# Altium project MSXIV_SteeringWheelInterfaceBoard.PrjPcb
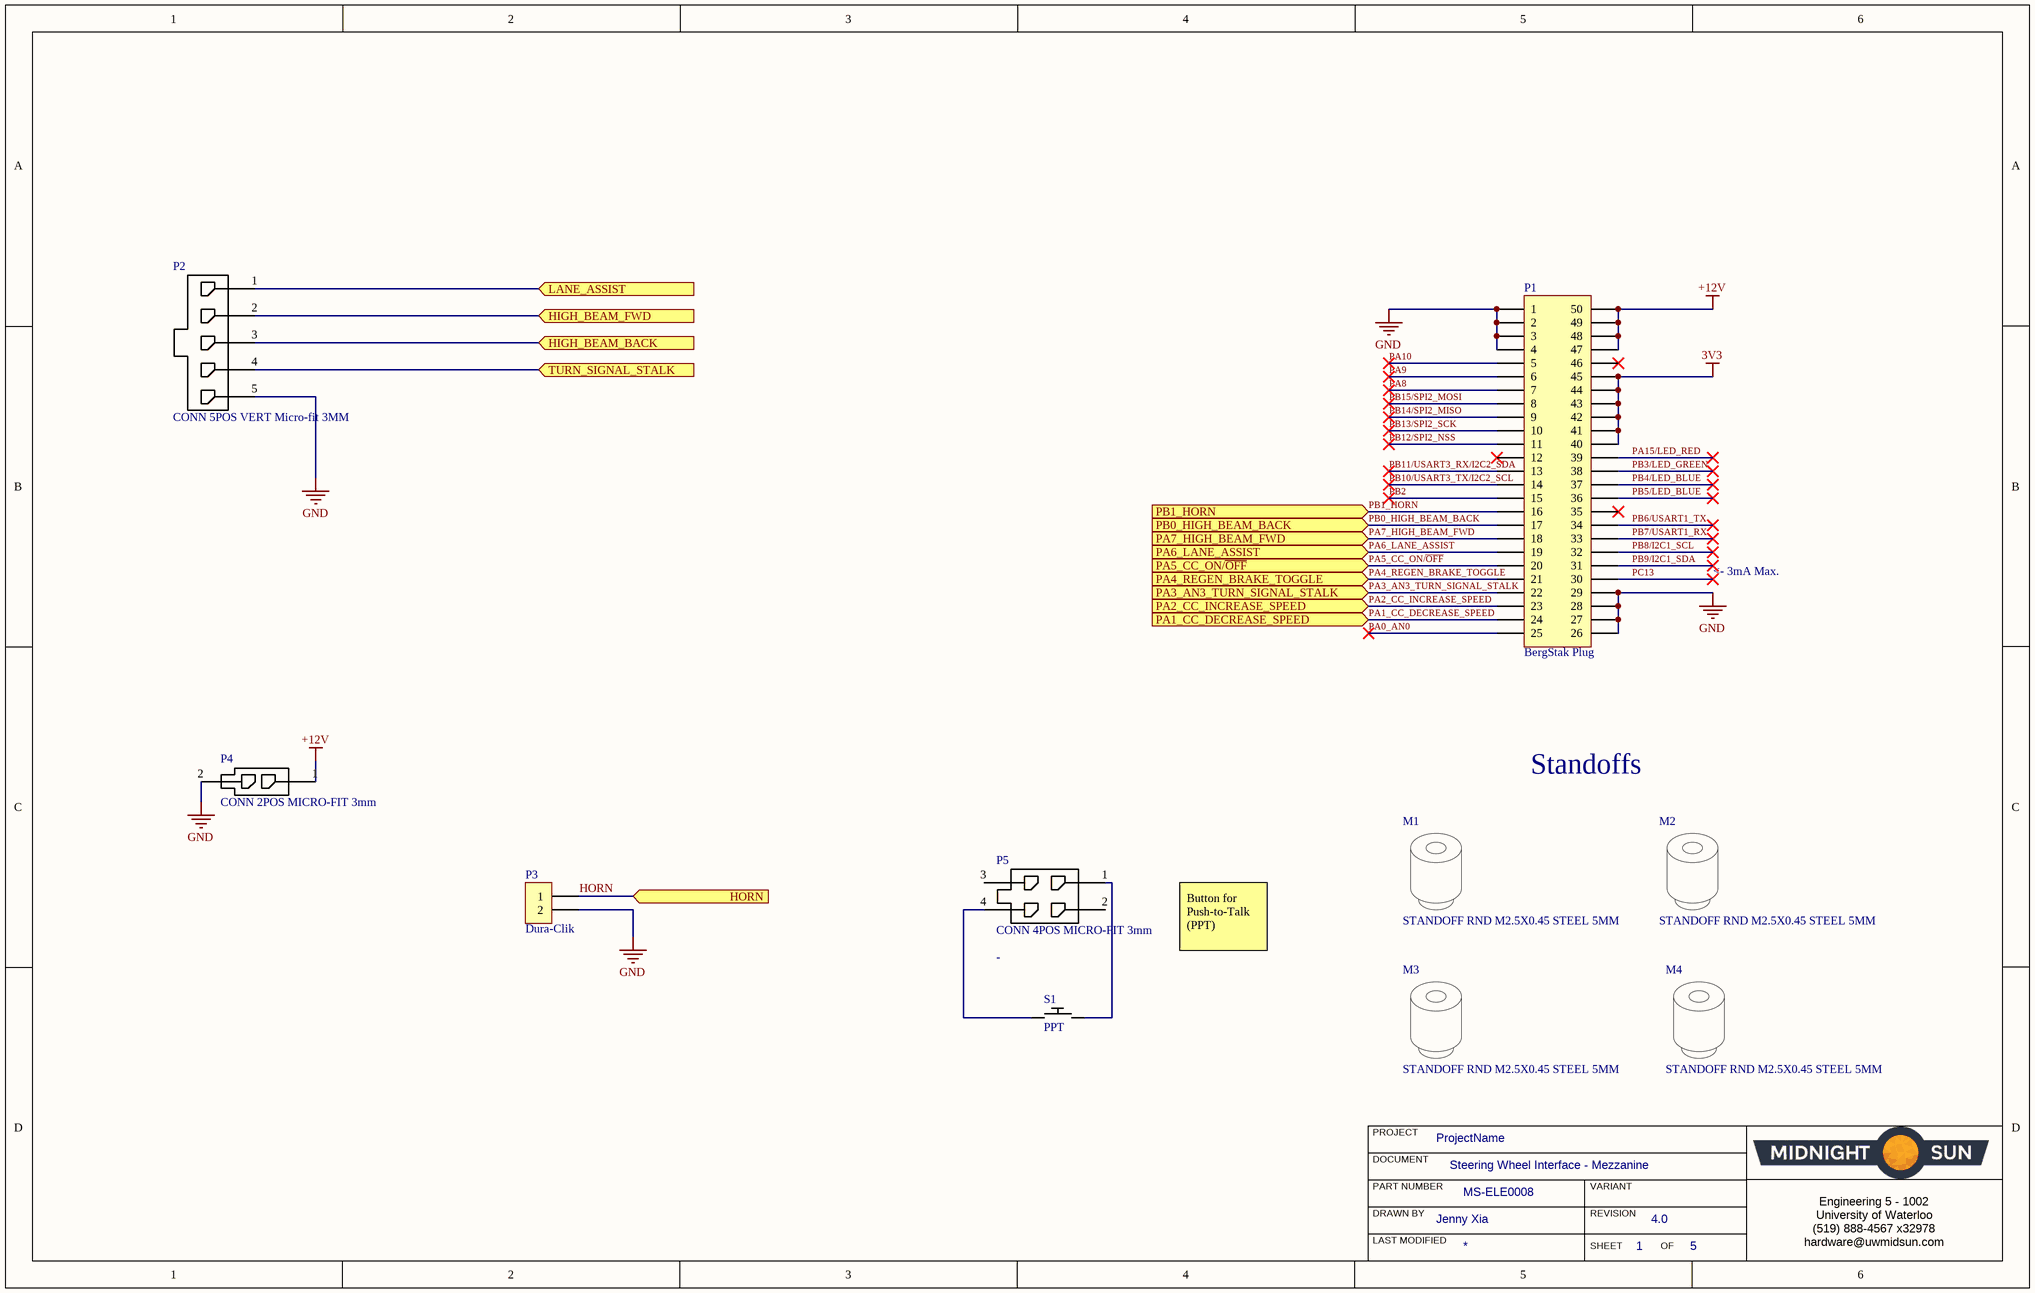
[diagram p0: Steering Wheel Carrier Board Mezzanine.SchDoc]
MSPartNumber: MS-ELE0008; ProjectAuthor: Jenny Xia; ProjectRevision: 4.0
5 sheets, 64 parts. Net scope: flat (ports and power ports of the same name join across sheets).
Board files: SteeringWheelConnectorBoard.PcbDoc, SteeringWheelBoard.PcbDoc
Sheets:
  Steering Wheel Carrier Board Mezzanine.SchDoc
  Steering Wheel Steering Stalk Connector.SchDoc
  Steering Wheel Interface Analog Inputs.SchDoc
  Steering Wheel Interface Digital Inputs.SchDoc
  Steering Wheel Interface Schmitt Inverters.SchDoc

## Sheet Steering Wheel Carrier Board Mezzanine.SchDoc: Steering Wheel Interface - Mezzanine
size B; Organization: Midnight Sun Solar Rayce Car Team; Address1: University of Waterloo; Address2: 200 University Ave W; Address3: Waterloo, ON, Canada; Address4: N2L 3E9; DocumentNumber: 1; SheetNumber: 1; SheetTotal: 5; Website: www.uwmidsun.com; ProjectName: ProjectName

### Parts
M1  STANDOFF RND M2.5X0.45 STEEL 5MM  [M2.5 Standoff]
M2  STANDOFF RND M2.5X0.45 STEEL 5MM  [M2.5 Standoff]
M3  STANDOFF RND M2.5X0.45 STEEL 5MM  [M2.5 Standoff]
M4  STANDOFF RND M2.5X0.45 STEEL 5MM  [M2.5 Standoff]
P1  Series: BergStak Plug  [CONN, Bergstak 50 Pos Plug]  (hidden comment: CONN 50POS Bergstak Plug 0.02")
P2  CONN 5POS VERT Micro-fit 3MM  [CONN, 5POS MICRO-FIT 3mm]
P3  Dura-Clik  [CONN, 2POS Dura-Click Vertical]
P4  CONN 2POS MICRO-FIT 3mm  [CONN, 2POS MICRO-FIT]
P5  CONN 4POS MICRO-FIT 3mm  [CONN 4POS MICROFIT (2x2)]
S1  PPT  [SW SPST-NO ESE-20C321]

### Ports
HIGH_BEAM_BACK (in), HIGH_BEAM_FWD (in), HORN (in), LANE_ASSIST (in), PA1_CC_DECREASE_SPEED (in), PA2_CC_INCREASE_SPEED (in), PA3_AN3_TURN_SIGNAL_STALK (in), PA4_REGEN_BRAKE_TOGGLE (in), PA5_CC_ON/~{OFF} (in), PA6_LANE_ASSIST (in), PA7_HIGH_BEAM_FWD (in), PB0_HIGH_BEAM_BACK (in), PB1_HORN (in), TURN_SIGNAL_STALK (in)

### Nets
3V3: P1.40 P1.41 P1.42 P1.43 P1.44 P1.45
+12V: P1.47 P1.48 P1.49 P1.50 P4.1
GND: P1.1 P1.2 P1.3 P1.4 P1.26 P1.27 P1.28 P1.29 P2.5 P3.2 P4.2
HIGH_BEAM_BACK: P2.3 ; port HIGH_BEAM_BACK
HIGH_BEAM_FWD: P2.2 ; port HIGH_BEAM_FWD
HORN: P3.1 ; port HORN
LANE_ASSIST: P2.1 ; port LANE_ASSIST
PA0_AN0: P1.25
PA1_CC_DECREASE_SPEED: P1.24 ; port PA1_CC_DECREASE_SPEED
PA2_CC_INCREASE_SPEED: P1.23 ; port PA2_CC_INCREASE_SPEED
PA3_AN3_TURN_SIGNAL_STALK: P1.22 ; port PA3_AN3_TURN_SIGNAL_STALK
PA4_REGEN_BRAKE_TOGGLE: P1.21 ; port PA4_REGEN_BRAKE_TOGGLE
PA5_CC_ON/~{OFF}: P1.20 ; port PA5_CC_ON/~{OFF}
PA6_LANE_ASSIST: P1.19 ; port PA6_LANE_ASSIST
PA7_HIGH_BEAM_FWD: P1.18 ; port PA7_HIGH_BEAM_FWD
PA8: P1.7
PA9: P1.6
PA10: P1.5
PA15/LED_RED: P1.39
PB0_HIGH_BEAM_BACK: P1.17 ; port PB0_HIGH_BEAM_BACK
PB1_HORN: P1.16 ; port PB1_HORN
PB2: P1.15
PB3/LED_GREEN: P1.38
PB4/LED_BLUE: P1.37
PB5/LED_BLUE: P1.36
PB6/USART1_TX: P1.34
PB7/USART1_RX: P1.33
PB8/I2C1_SCL: P1.32
PB9/I2C1_SDA: P1.31
PB10/USART3_TX/I2C2_SCL: P1.14
PB11/USART3_RX/I2C2_SDA: P1.13
PB12/SPI2_NSS: P1.11
PB13/SPI2_SCK: P1.10
PB14/SPI2_MISO: P1.9
PB15/SPI2_MOSI: P1.8
PC13: P1.30
TURN_SIGNAL_STALK: P2.4 ; port TURN_SIGNAL_STALK
NetP5_1: P5.1 S1.2
NetP5_4: P5.4 S1.1

Not connected (* = marked no-connect by the designer): P1 12* 35* 46*; P5 2 3

### Notes on the sheet
- <- 3mA Max.
- (near M2) Standoffs
- Button for Push-to-Talk (PPT)
- PROJECT
- DOCUMENT
- DRAWN BY
- LAST MODIFIED
- PART NUMBER
- REVISION
- SHEET
- VARIANT
- OF
- Engineering 5 - 1002
  University of Waterloo
  (519) 888-4567 x32978
  hardware@uwmidsun.com

### Library data of the parts
M1-M4 = CMP-003-0255-1: Manufacturer: Wurth Electronics; Manufacturer Part Number: 9774050151R; Plating: Tin; Outside Diameter: 0.201inch; Threaded/Unthreaded: Threaded; Pricing 1: 1 = 1.09000, 10 = 1.03000, 50 = 0.91800, 100 = 0.84000 (USD); Material: Steel; Stock 1: 24846; Design Item ID: STANDOFF RND M2.5X0.45 STEEL 5MM; REACH SVHC: Unknown; Source: Schematic Diagrams.SchLib; RoHS: Yes; Length: 0.252inch
P1 = CONN 50POS Bergstak Plug 0.02": 50 Position Connector Plug, Outer Shroud Contacts Surface Mount Gold; Manufacturer 1: Amphenol FCI; Manufacturer Part Number 1: 10132797-055100LF; Number of Positions: 50; Mated Stacking Heights: 5mm; Pitch: 0.020" (0.50mm); Supplier 1: Digi-Key; Supplier Part Number 1: 609-5226-1-ND; Packaging: Cut Tape (CT); Part Status: Active; Connector Type: Plug, Outer Shroud Contacts; Number of Rows: 2; Mounting Type: Surface Mount; Contact Finish: Gold; Contact Finish Thickness: 1µin (0.025µm); Height Above Board: 0.169" (4.30mm); ComponentLink1URL: http://portal.fciconnect.com/Comergent//fci/drawing/10132797.pdf; ComponentLink1Description: http://portal.fciconnect.com/Comergent//fci/drawing/10132797.pdf
P2 = CMP-022-0000-1: Conn Power HDR 5 POS 3mm Solder ST Thru-Hole 5 Terminal 1 Port Micro-Fit 3.0™ Tray; Manufacturer Part Number: 0436500516; Manufacturer: Molex; Max Voltage Rating (AC): 250V; Connector Type: Male Pin; Number of Contacts: 5; Number of Ports: 1; Min Operating Temperature: -40°C; Source: SchlibSolarSense.SchLib; Design Item ID: CONN 5POS VERT Micro-fit 3MM; Number of Terminals: 5; Stock 1: 1615; Orientation: Straight; Contact Plating: Gold; Contact Material: Brass; Number of Rows: 1; Fastening Type: Ramp; Max Operating Temperature: 105°C; Termination: Solder; Mount: Through Hole; ComponentLink1URL: https://datasheet.ciiva.com/6813/436500516-sd-6813986.pdf?src-supplier=Digi-Key; Color: Black; Length: 18.65mm; ComponentLink1Description: https://datasheet.ciiva.com/6813/436500516-sd-6813986.pdf?src-supplier=Digi-Key; Number of Positions: 5; ComponentLink2URL: https://datasheet.ciiva.com/3943/304280436500516-pcb-headers-3943315.pdf?src-supplier=Arrow; Packaging: Tray; Pitch: 3mm; Housing Material: Polymer; RoHS: Yes; ComponentLink2Description: https://datasheet.ciiva.com/3943/304280436500516-pcb-headers-3943315.pdf?src-supplier=Arrow; Pricing 1: 1=1.52000, 10=1.38200, 100=1.18480, 500=0.98736, 1000=0.84630, 5000=0.75039, 10000=0.73346 (USD); Depth: 5.57mm
P3 = CONN 2POS DURA-CLIK 0.079" VERT: 2 Positions Header, Shrouded Connector 0.079" (2.00mm) Surface Mount, Vertical Tin; Manufacturer: Molex, LLC; Manufacturer Part Number: 5600200220; Style: Board to Cable/Wire; Shrouding: Shrouded - 4 Wall; Number of Positions: 2; Number of Positions Loaded: All; Mated Stacking Heights: 9.3mm; Supplier 1: Digi-Key; RoHS: RoHS Compliant; Category: Connectors, Interconnects; Stock 1: 11912; Pricing 1: 1=1.16, 10=1.012, 25=0.952, 50=0.9122, 100=0.8727, 250=0.79336 (CAD); Packaging: Cut Tape (CT); Part Status: Active; Connector Type: Header; Contact Type: Male Pin; Pitch - Mating: 0.079" (2.00mm); Number of Rows: 1; Row Spacing - Mating: -; Mounting Type: Surface Mount; Termination: Solder; Fastening Type: Latch Lock; Contact Length - Mating: -; Contact Length - Post: -; Overall Contact Length: -; Insulation Height: 0.315" (8.00mm); Contact Shape: Square; Contact Finish - Mating: Tin; Contact Finish Thickness - Mating: -; Contact Finish - Post: Tin; Contact Material: Copper Alloy; Insulation Material: Polyamide (PA), Nylon; Features: Solder Retention; Operating Temperature: -; Ingress Protection: -; Material Flammability Rating: -; Insulation Color: Natural; Current Rating: -; Voltage Rating: -; Contact Finish Thickness - Post: -; Applications: Automotive, Industrial; ComponentLink1URL: http://www.molex.com/pdm_docs/sd/5600200220_sd.pdf; ComponentLink1Description: http://www.molex.com/pdm_docs/sd/5600200220_sd.pdf; Supplier Part Number 1: WM10862CT-ND
P4 = CMP-007-0003-1: Connector Header Through Hole 2 position; Manufacturer: Molex; Manufacturer Part Number: 43045-0227; Number of Ports: 1; Number of Contacts: 2; Glow Wire Compliant: Compliant; Voltage Rating: 600V; Current Rating: 5A; Max Voltage Rating (DC): 250.25kV; Gender: Male; Contact Resistance: 10mR; ComponentLink3URL: http://uk.rs-online.com/webdocs/13c3/0900766b813c3a46.pdf; Contact Material: Brass; Halogen Free: Low Halogen; ComponentLink2URL: http://www.mouser.com/ds/2/276/0430450227_PCB_HEADERS-142611.pdf; Length: 7.15mm; Source: Schematic Diagrams.SchLib; Min Operating Temperature: -40°C; Contact Plating: Tin; Number of Terminals: 2; Number of Rows: 2; Radiation Hardening: No; ComponentLink4URL: http://www.molex.com/webdocs/datasheets/pdf/en-us/0430450227_PCB_HEADERS.pdf; Packaging: Tray; Depth: 8.77mm; Pitch: 3mm; Stock 1: 3657; Mount: Through Hole; Max Operating Temperature: 105°C; ComponentLink1Description: http://www.onlinecomponents.com/productFiles/mf-MOL/307170430450227_pcb_headers.pdf; Orientation: Vertical; Row Spacing: 3mm; Case/Package: 3168; Pricing 1: 1=0.84, 10=0.74, 25=0.6968, 50=0.6676, 100=0.6387, 250=0.5806, 500=0.52254, 1000=0.46448, 2500=0.42094 (USD); ComponentLink2Description: http://www.mouser.com/ds/2/276/0430450227_PCB_HEADERS-142611.pdf; ComponentLink3Description: http://uk.rs-online.com/webdocs/13c3/0900766b813c3a46.pdf; ComponentLink1URL: http://www.onlinecomponents.com/productFiles/mf-MOL/307170430450227_pcb_headers.pdf; Number of Positions: 2; Design Item ID: CONN 2POS MICRO-FIT 3mm; Housing Colour: Black; Termination: Solder; Number of Circuits: 2; ComponentLink4Description: http://www.molex.com/webdocs/datasheets/pdf/en-us/0430450227_PCB_HEADERS.pdf; Housing Material: Thermoplastic
P5 = CMP-003-0192-1: Micro-Fit 3.0 Vertical Header, 3.00mm Pitch, Dual Row, 4 Circuits, with PCB Polarizing Peg, Tin, Glow-Wire Capable, Black; Manufacturer: Molex, LLC; Manufacturer Part Number: 430450427; Contact Resistance: 10mR; Pitch - Mating: 0.118" (3.00mm); Number of Contacts: 4; Number of Ports: 1; Number of Positions: 6; Row Spacing: 0.118inch; Style: Board to Cable/Wire; Shrouding: Shrouded - 4 Wall; Material Flammability Rating: UL94 V-0; Contact Length - Post: 0.125" (3.18mm); Number of Positions Loaded: All; Contact Finish Thickness - Post: -; RoHS: RoHS Compliant; Ingress Protection: -; Number of Rows: 2; Operating Temperature: -; Contact Material: Brass; Contact Finish - Mating: Tin; Mounting Type: Through Hole; Current Rating: -; Overall Contact Length: -; Insulation Material: Liquid Crystal Polymer (LCP), Glass Filled; Design Item ID: CONN 4POS MICRO-FIT 3mm; Voltage Rating: -; Depth: 8.77mm; Part Status: Active; ComponentLink1Description: http://www.molex.com/webdocs/datasheets/pdf/en-us/0430450427_PCB_HEADERS.pdf; Pitch: 3mm; Packaging: Tray; Mated Stacking Heights: -; Contact Length - Mating: -; Features: Board Guide; Row Spacing - Mating: 0.118" (3.00mm); Fastening Type: Locking Ramp; Orientation: Straight; Length: 10.15mm; Housing Material: Polymer; Mount: Through Hole; Insulation Height: 0.390" (9.91mm); Termination: Solder; Connector Type: Header; Package Quantity: 2232; Housing Color: Black; Contact Plating: Tin; ComponentLink1URL: http://www.molex.com/webdocs/datasheets/pdf/en-us/0430450427_PCB_HEADERS.pdf; Number of Terminals: 4; Insulation Color: Black; Source: Schematic Diagrams.SchLib; Contact Finish Thickness - Mating: 60.0µin (1.52µm); Contact Finish - Post: Tin; Min Operating Temperature: -40°C; Contact Type: Male Pin; Max Operating Temperature: 105°C; Contact Shape: Square; Color: Black; Applications: General Purpose, Medical, Military, Telecommunications
S1 = SW PUSH SPST-NO 0.1A 14V: Pushbutton Switch SPST-NO Standard Through Hole; Manufacturer: Panasonic; Manufacturer Part Number: ESE20C321; Switch Function: Off-Mom; Actuator Type: Square, Button; Operating Force: 4N; Voltage Rating (DC): 14V; Throw Configuration: SPST; Current Rating: 100mA; Supplier 1: Digi-Key; Supplier Part Number 1: P11161S-ND; RoHS: Yes; Stock 1: 1919; Pricing 1: 1 = 1.17000, 10 = 1.09200, 25 = 1.04040, 50 = 0.98820, 100 = 0.96220, 250 = 0.93620, 500 = 0.88418, 1000 = 0.83216, 5000 = 0.70214 (USD); Packaging: Bulk; ComponentLink1URL: https://www.digikey.ca/product-detail/en/panasonic-electronic-components/ESE-20C321/P11161S-ND/354749; ComponentLink1Description: Digikey; Mount: Through Hole; Min Operating Temperature: -30°C; Max Operating Temperature: 80°C; Max Voltage Rating (DC): 14V; Package Quantity: 1200; Contact Current Rating: 100mA; Termination: PC Pin; Orientation: Straight; Radiation Hardening: No; REACH SVHC: No SVHC; Lead Free: Lead Free; ComponentLink2URL: https://datasheet.ciiva.com/46399/1790644-46399477.pdf?src-supplier=Element14; ComponentLink2Description: https://datasheet.ciiva.com/46399/1790644-46399477.pdf?src-supplier=Element14; ComponentLink3URL: https://datasheet.ciiva.com/16437/atu0000ce7-16437878.pdf?src-supplier=Future+Electronics; ComponentLink3Description: https://datasheet.ciiva.com/16437/atu0000ce7-16437878.pdf?src-supplier=Future+Electronics; ComponentLink4URL: https://datasheet.ciiva.com/8663/atu0000ce7-8663607.pdf?src-supplier=Avnet; ComponentLink4Description: https://datasheet.ciiva.com/8663/atu0000ce7-8663607.pdf?src-supplier=Avnet; ComponentLink5URL: https://datasheet.ciiva.com/2869/atu0000ce7-2869467.pdf?src-supplier=Digi-Key; ComponentLink5Description: https://datasheet.ciiva.com/2869/atu0000ce7-2869467.pdf?src-supplier=Digi-Key

## Sheet Steering Wheel Steering Stalk Connector.SchDoc: Steering Wheel - Steering Stalk Connector
size B; Organization: Midnight Sun Solar Rayce Car Team; Address1: University of Waterloo; Address2: 200 University Ave W; Address3: Waterloo, ON, Canada; Address4: N2L 3E9; DocumentNumber: 1; SheetNumber: 2; SheetTotal: 5; Website: www.uwmidsun.com; ProjectName: ProjectName
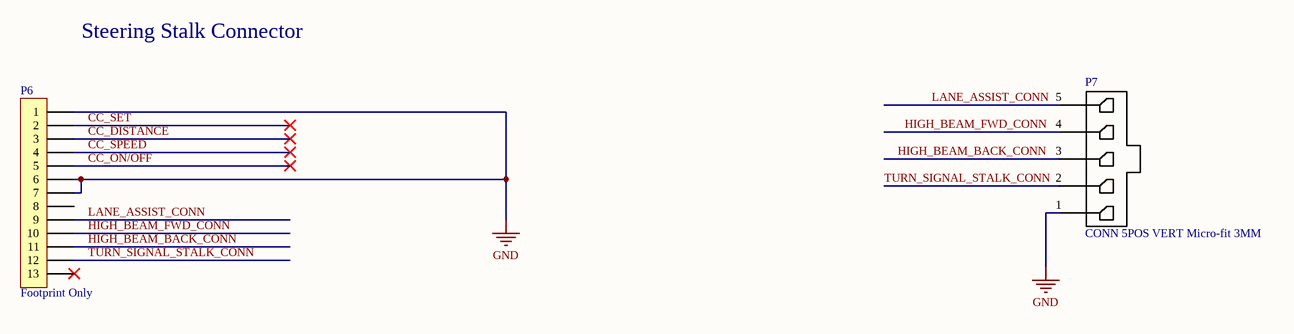
[diagram p1: Steering Wheel Steering Stalk Connector.SchDoc]

### Parts
P6  Footprint Only  [CONN 13POS CARD EDGE]  (no BOM)
P7  CONN 5POS VERT Micro-fit 3MM  [CONN, 5POS MICRO-FIT 3mm]

### Nets
GND: P6.1 P6.6 P6.7 P7.1
CC_DISTANCE: P6.3
CC_ON/~{OFF}: P6.5
CC_SET: P6.2
CC_SPEED: P6.4
HIGH_BEAM_BACK_CONN: P6.11 P7.3
HIGH_BEAM_FWD_CONN: P6.10 P7.4
LANE_ASSIST_CONN: P6.9 P7.5
TURN_SIGNAL_STALK_CONN: P6.12 P7.2

Not connected (* = marked no-connect by the designer): P6 8 13*

### Notes on the sheet
- Steering Stalk Connector
- PROJECT
- DOCUMENT
- DRAWN BY
- LAST MODIFIED
- PART NUMBER
- REVISION
- SHEET
- VARIANT
- OF
- Engineering 5 - 1002
  University of Waterloo
  (519) 888-4567 x32978
  hardware@uwmidsun.com

### Library data of the parts
P6 = CONN 13POS 0.1" CARD EDGE
P7 = CMP-022-0000-1: as P2 on sheet Steering Wheel Carrier Board Mezzanine; Min Operating Temperature: -40°C; Source: SchlibSolarSense.SchLib; Design Item ID: CONN 5POS VERT Micro-fit 3MM; Number of Terminals: 5; Stock 1: 1615; Orientation: Straight; Contact Plating: Gold; Contact Material: Brass; Number of Rows: 1; Fastening Type: Ramp; Max Operating Temperature: 105°C; Termination: Solder; Mount: Through Hole; ComponentLink1URL: https://datasheet.ciiva.com/6813/436500516-sd-6813986.pdf?src-supplier=Digi-Key; Color: Black; Length: 18.65mm; ComponentLink1Description: https://datasheet.ciiva.com/6813/436500516-sd-6813986.pdf?src-supplier=Digi-Key; Number of Positions: 5; ComponentLink2URL: https://datasheet.ciiva.com/3943/304280436500516-pcb-headers-3943315.pdf?src-supplier=Arrow; Packaging: Tray; Pitch: 3mm; Housing Material: Polymer; RoHS: Yes; ComponentLink2Description: https://datasheet.ciiva.com/3943/304280436500516-pcb-headers-3943315.pdf?src-supplier=Arrow; Pricing 1: 1=1.52000, 10=1.38200, 100=1.18480, 500=0.98736, 1000=0.84630, 5000=0.75039, 10000=0.73346 (USD); Depth: 5.57mm

## Sheet Steering Wheel Interface Analog Inputs.SchDoc: Steering Wheel Interface - Analog Inputs
size B; Organization: Midnight Sun Solar Rayce Car Team; Address1: University of Waterloo; Address2: 200 University Ave W; Address3: Waterloo, ON, Canada; Address4: N2L 3E9; DocumentNumber: 2; SheetNumber: 3; Website: www.uwmidsun.com; SheetTotal: 5; ProjectName: ProjectName
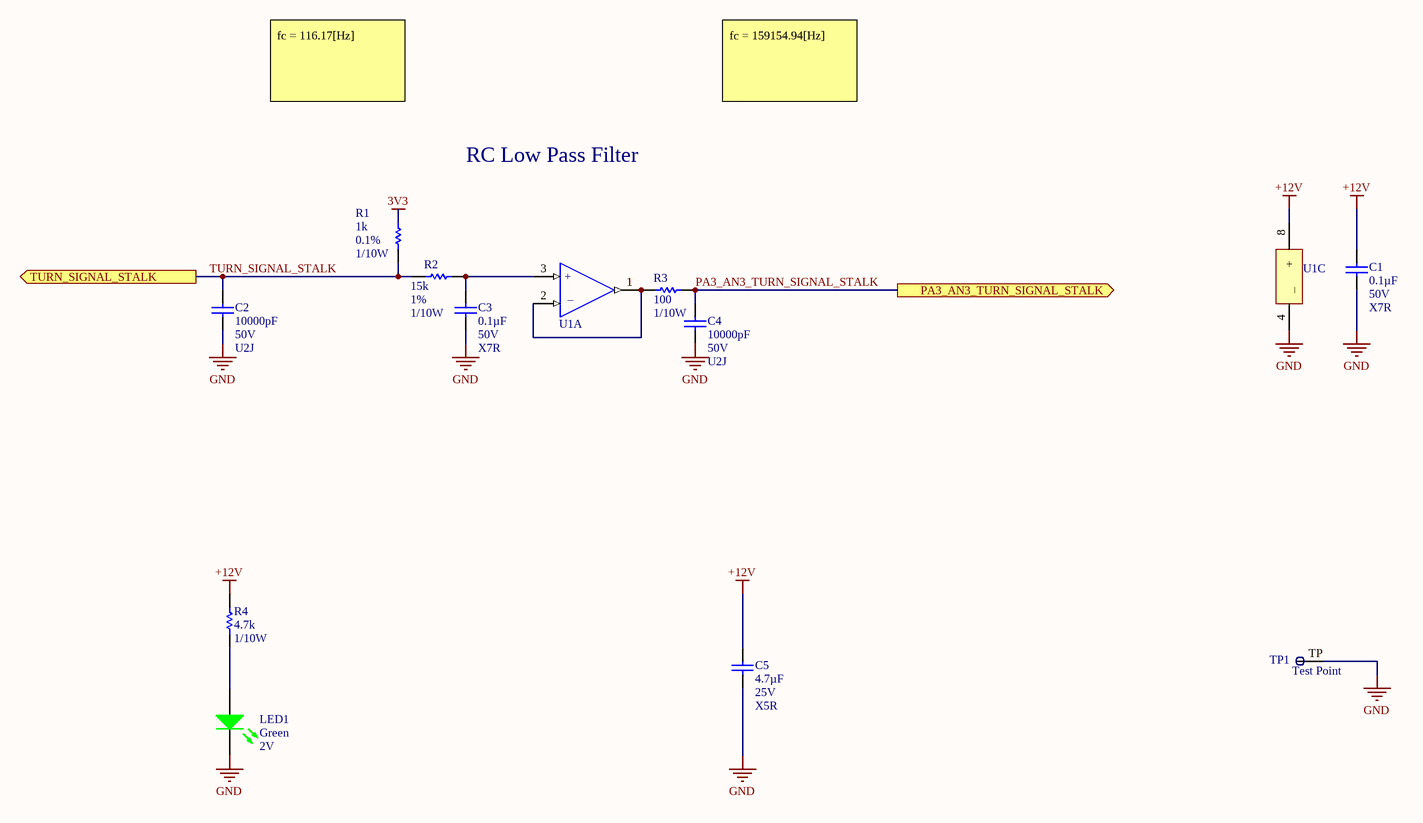
[diagram p2: Steering Wheel Interface Analog Inputs.SchDoc]

### Parts
C1  Capacitance: 0.1µF  Voltage: 50V  Temperature Coefficient: X7R  [CAP, 0603]  (hidden comment: CAP CER 0.1UF 50V 10% X7R 0603)
C2  Capacitance: 10000pF  Voltage: 50V  Temperature Coefficient: U2J  [CAP, 0603]  (hidden comment: CAP CER 10nF 50V 5% X7R 0603)
C3  Capacitance: 0.1µF  Voltage: 50V  Temperature Coefficient: X7R  [CAP, 0603]  (hidden comment: CAP CER 0.1UF 50V 10% X7R 0603)
C4  Capacitance: 10000pF  Voltage: 50V  Temperature Coefficient: U2J  [CAP, 0603]  (hidden comment: CAP CER 10nF 50V 5% X7R 0603)
C5  Capacitance: 4.7µF  Voltage: 25V  Temperature Coefficient: X5R  [CAP, 0603]  (hidden comment: CAP CER 4.7UF 25V 10% X5R 0603)
LED1  Color: Green  Voltage - Forward (Vf) (Typ): 2V  [LED_0603]  (hidden comment: LED GREEN CLEAR 2V 0603)
R1  Resistance: 1k  Tolerance: 0.1%  Power Rating: 1/10W  [RES, 0603]  (hidden comment: RES SMD 1K OHM 0.1% 1/10W 0603)
R2  Resistance: 15k  Tolerance: 1%  Max Power Dissipation: 1/10W  [RES, 0603]  (hidden comment: RES SMD 15K OHM 1% 1/10W 0603)
R3  Resistance: 100  Power: 1/10W  [RES, 0603]  (hidden comment: RES 100 OHM 1% 1/10W 0603)
R4  Resistance (Ohms): 4.7k  Power (Watts): 1/10W  [RES, 0603]  (hidden comment: RES 4.7K OHM 1% 1/10W 0603)
TP1  Test Point  [Test Point]  (no BOM)
U1  IC OP AMP DUAL GP RR 10MHZ 8-VSSOP  [IC OP AMP DUAL 8-VSSOP]  (value not drawn)  (parts A,C of 3)

### Ports
PA3_AN3_TURN_SIGNAL_STALK (out), TURN_SIGNAL_STALK (out)

### Nets
3V3: R1.1
+12V: C1.1 C5.1 R4.1 U1.8(+)
GND: C1.2 C2.2 C3.2 C4.2 C5.2 LED1.2(K) TP1.TP U1.4(_)
PA3_AN3_TURN_SIGNAL_STALK: C4.1 R3.1 ; port PA3_AN3_TURN_SIGNAL_STALK
TURN_SIGNAL_STALK: C2.1 R1.2 R2.2 ; port TURN_SIGNAL_STALK
NetC3_1: C3.1 R2.1 U1.3(+IN_A)
NetLED1_1: LED1.1(A) R4.2
NetR3_2: R3.2 U1.1(OUT_A) U1.2(-IN_A)

### Notes on the sheet
- fc = 116.17[Hz]
- fc = 159154.94[Hz]
- RC Low Pass Filter
- PROJECT
- DOCUMENT
- DRAWN BY
- LAST MODIFIED
- PART NUMBER
- REVISION
- SHEET
- VARIANT
- OF
- Engineering 5 - 1002
  University of Waterloo
  (519) 888-4567 x32978
  hardware@uwmidsun.com

### Library data of the parts
C1 C3 = CAP CER 0.1UF 50V 10% X7R 0603: 0.10µF ±10% 50V Ceramic Capacitor X7R 0603 (1608 Metric); Manufacturer 1: AVX Corporation; Manufacturer Part Number 1: 06035C104KAT2A; Supplier 1: Digi-Key; Supplier Part Number 1: 478-5052-1-ND; Packaging: Cut Tape (CT); Part Status: Active; Operating Temperature: -55°C ~ 125°C; Ratings: -; Mounting Type: Surface Mount, MLCC; Package / Case: 0603 (1608 Metric); Size / Dimension: 0.063" L x 0.032" W (1.60mm x 0.81mm); Height - Seated (Max): -; Thickness (Max): 0.035" (0.90mm); Lead Spacing: -; Lead Style: -; ComponentLink1URL: http://datasheets.avx.com/X7RDielectric.pdf; ComponentLink1Description: http://datasheets.avx.com/X7RDielectric.pdf; Tolerance: ±10%
C2 C4 = CAP CER 10nF 50V 5% X7R 0603: 10000pF ±5% 50V Ceramic Capacitor U2J 0603 (1608 Metric); Manufacturer 1: KEMET; Manufacturer Part Number 1: C0603C103J5JAC7867; Supplier 1: Digi-Key; Supplier Part Number 1: 399-13384-1-ND; Packaging: Cut Tape (CT); Part Status: Active; Operating Temperature: -55°C ~ 125°C; Ratings: -; Failure Rate: -; Mounting Type: Surface Mount, MLCC; Package / Case: 0603 (1608 Metric); Size / Dimension: 0.063" L x 0.032" W (1.60mm x 0.80mm); Height - Seated (Max): -; Thickness (Max): 0.034" (0.87mm); Lead Spacing: -; Lead Style: -; ComponentLink1URL: http://www.kemet.com/docfinder?Partnumber=C0603C103J5JAC7867; ComponentLink1Description: http://www.kemet.com/docfinder?Partnumber=C0603C103J5JAC7867; Tolerance: ±5%
C5 = CAP CER 4.7UF 25V 10% X5R 0603: 4.7µF ±10% 25V Ceramic Capacitor X5R 0603 (1608 Metric); Manufacturer 1: Murata Electronics North America; Manufacturer Part Number 1: GRM188R61E475KE11D; Supplier 1: Digi-Key; Supplier Part Number 1: 490-7203-1-ND; Packaging: Cut Tape (CT); Part Status: Active; Operating Temperature: -55°C ~ 85°C; Ratings: -; Mounting Type: Surface Mount, MLCC; Package / Case: 0603 (1608 Metric); Size / Dimension: 0.063" L x 0.031" W (1.60mm x 0.80mm); Height - Seated (Max): -; Thickness (Max): 0.031" (0.80mm); Lead Spacing: -; Lead Style: -; ComponentLink1URL: http://www.murata.com/~/media/webrenewal/support/library/catalog/products/capacitor/mlcc/c02e.ashx; ComponentLink1Description: http://www.murata.com/~/media/webrenewal/support/library/catalog/products/capacitor/mlcc/c02e.ashx; Tolerance: ±10%
LED1 = LED GREEN CLEAR 2V 0603: Green 572nm LED Indication - Discrete 2V 0603 (1608 Metric); Manufacturer: Wurth Electronics Inc.; Manufacturer Part Number: 150060VS75000; Lens Color: Colorless; Millicandela Rating: 40mcd; Lens Style/Size: Rectangle with Flat Top, 1.10mm x 0.70mm; Current - Test: 20mA; Viewing Angle: 140°; Wavelength - Dominant: 570nm; Supplier 1: Digi-Key; RoHS: RoHS Compliant; Category: Optoelectronics; Stock 1: 9408; Pricing 1: 1=0.21, 100=0.1617, 500=0.13964 (CAD); Packaging: Cut Tape (CT); Part Status: Active; Lens Transparency: Clear; Mounting Type: Surface Mount; Wavelength - Peak: 572nm; Features: -; Package / Case: 0603 (1608 Metric); Supplier Device Package: 0603; Size / Dimension: 1.60mm L x 0.80mm W; Height (Max): 0.80mm; ComponentLink1URL: http://katalog.we-online.de/led/datasheet/150060VS75000.pdf; ComponentLink1Description: http://katalog.we-online.de/led/datasheet/150060VS75000.pdf; Supplier Part Number 1: 732-4980-1-ND
R1 = RES SMD 1K OHM 0.1% 1/10W 0603: 1 kOhms ±0.1% 0.1W, 1/10W Chip Resistor 0603 (1608 Metric) Automotive AEC-Q200 Thin Film; Manufacturer: Panasonic; Manufacturer Part Number: ERA3AEB102V; Voltage Rating: 75V; Temperature Coefficient: 25ppm/°C; Max Power Dissipation: 100mW; ComponentLink1URL: https://www.digikey.ca/product-detail/en/panasonic-electronic-components/ERA-3AEB102V/P1.0KDBCT-ND/1466052; ComponentLink1Description: Digikey; Supplier 1: Digi-Key; Supplier Part Number 1: P1.0KDBCT-ND; RoHS: Yes; Stock 1: 1293788; Pricing 1: 1 = 0.35000, 10 = 0.30000, 100 = 0.11720, 1000 = 0.04906, 2500 = 0.04498 (USD); Mount: Surface Mount; Case/Package: 0603; Number of Pins: 2; Case Code (Metric): 1608; Case Code (Imperial): 0603; Contact Plating: Tin; Min Operating Temperature: -55°C; Max Operating Temperature: 155°C; Packaging: Tape and Reel; Package Quantity: 5000; Composition: Thin Film; Number of Terminations: 2; Termination: SMD/SMT; Military Standard: Not; Length: 1.6mm; Height: 0.45mm; Width: 0.8mm; Depth: 0.8mm; Radiation Hardening: No; REACH SVHC: No SVHC; ComponentLink2URL: http://www.farnell.com/datasheets/485442.pdf; ComponentLink2Description: http://www.farnell.com/datasheets/485442.pdf; ComponentLink3URL: http://industrial.panasonic.com/www-data/pdf/AOA0000/AOA0000CE26.pdf; ComponentLink3Description: http://industrial.panasonic.com/www-data/pdf/AOA0000/AOA0000CE26.pdf; ComponentLink4URL: http://www.farnell.com/datasheets/2052875.pdf; ComponentLink4Description: http://www.farnell.com/datasheets/2052875.pdf; ComponentLink5URL: http://www.farnell.com/datasheets/1776116.pdf; ComponentLink5Description: http://www.farnell.com/datasheets/1776116.pdf; ComponentLink6URL: http://uk.rs-online.com/webdocs/148c/0900766b8148c4ab.pdf; ComponentLink6Description: http://uk.rs-online.com/webdocs/148c/0900766b8148c4ab.pdf; ComponentLink7URL: http://www.farnell.com/datasheets/2059650.pdf; ComponentLink7Description: http://www.farnell.com/datasheets/2059650.pdf; ComponentLink8URL: http://www.produktinfo.conrad.com/datenblaetter/450000-474999/451250-da-01-en-WIDERSTAND_0603_ERA.pdf; ComponentLink8Description: http://www.produktinfo.conrad.com/datenblaetter/450000-474999/451250-da-01-en-WIDERSTAND_0603_ERA.pdf; ComponentLink9URL: http://uk.rs-online.com/webdocs/148c/0900766b8148c48a.pdf; ComponentLink9Description: http://uk.rs-online.com/webdocs/148c/0900766b8148c48a.pdf; ComponentLink10URL: https://industrial.panasonic.com/cdbs/www-data/pdf/RDM0000/AOA0000C307.pdf; ComponentLink10Description: https://industrial.panasonic.com/cdbs/www-data/pdf/RDM0000/AOA0000C307.pdf; ComponentLink11URL: http://www.alliedelec.com/m/d/b6b0537e86f421aa7f5975bb1d8f429a.pdf; ComponentLink11Description: http://www.alliedelec.com/m/d/b6b0537e86f421aa7f5975bb1d8f429a.pdf; ComponentLink12URL: http://www.produktinfo.conrad.com/datenblaetter/450000-474999/450752-da-01-en-WIDERSTAND_0603_ERA.pdf; ComponentLink12Description: http://www.produktinfo.conrad.com/datenblaetter/450000-474999/450752-da-01-en-WIDERSTAND_0603_ERA.pdf
R2 = RES SMD 15K OHM 1% 1/10W 0603: 15 kOhms ±1% 0.1W, 1/10W Chip Resistor 0603 (1608 Metric) Moisture Resistant Thick Film; Manufacturer: Yageo; Manufacturer Part Number: RC0603FR-0715KL; Power Rating: 100mW; Voltage Rating: 50V; Temperature Coefficient: 100ppm/°C; Case/Package: 0603; Case Code (Imperial): 0603; Case Code (Metric): 1608; Min Operating Temperature: -55°C; Max Operating Temperature: 155°C; Packaging: Tape and Reel; Termination: SMD/SMT; Composition: Thick Film; Military Standard: Not; Voltage Rating (DC): 50V; Length: 1.6mm; Height: 0.022inch; Width: 0.031inch; Depth: 0.8mm; Lead Free: Lead Free; ComponentLink1URL: https://www.digikey.ca/product-detail/en/yageo/RC0603FR-0715KL/311-15.0KHRCT-ND/729900; ComponentLink1Description: Digikey; Features: Moisture Resistant; Number of Pins: 2; Number of Terminations: 2; Package Quantity: 1; REACH SVHC: Unknown; Supplier 1: Digi-Key; RoHS: Yes; Stock 1: 8611420; Pricing 1: 1 = 0.10000, 10 = 0.02400, 100 = 0.00970, 1000 = 0.00437, 2500 = 0.00379 (USD); ComponentLink2URL: http://www.yageo.com/documents/recent/PYu-RC_Group_51_RoHS_L_10.pdf; ComponentLink2Description: http://www.yageo.com/documents/recent/PYu-RC_Group_51_RoHS_L_10.pdf; ComponentLink3URL: http://www.yageo.com/documents/recent/PYu-RC_Group_51_RoHS_L_9.pdf; ComponentLink3Description: http://www.yageo.com/documents/recent/PYu-RC_Group_51_RoHS_L_9.pdf; ComponentLink4URL: https://www.verical.com/server-webapp/html/getDatasheet?partID=327895; ComponentLink4Description: https://www.verical.com/server-webapp/html/getDatasheet?partID=327895; Supplier Part Number 1: 311-15.0KHRCT-ND
R3 = RES 100 OHM 1% 1/10W 0603: 100 Ohm ±1% 0.1W, 1/10W Chip Resistor 0603 (1608 Metric) Moisture Resistant Thick Film; Manufacturer 1: Yageo; Manufacturer Part Number 1: RC0603FR-07100RL; Temperature Coefficient: ±100ppm/°C; Supplier 1: Digi-Key; Supplier Part Number 1: 311-100HRCT-ND; Packaging: Cut Tape (CT); Part Status: Active; Composition: Thick Film; Operating Temperature: -55°C ~ 155°C; Package / Case: 0603 (1608 Metric); Supplier Device Package: 0603; Size / Dimension: 0.063" L x 0.031" W (1.60mm x 0.80mm); Height - Seated (Max): 0.022" (0.55mm); Failure Rate: -; ComponentLink1URL: http://www.yageo.com/documents/recent/PYu-RC_Group_51_RoHS_L_7.pdf; ComponentLink1Description: http://www.yageo.com/documents/recent/PYu-RC_Group_51_RoHS_L_7.pdf; Tolerance: ±1%
R4 = RES 4.7K OHM 1% 1/10W 0603: 4.7k Ohm ±1% 0.1W, 1/10W Chip Resistor 0603 (1608 Metric) Moisture Resistant Thick Film; Manufacturer 1: Yageo; Manufacturer Part Number 1: RC0603FR-074K7L; Description 1: RES SMD 4.7K OHM 1% 1/10W 0603; Temperature Coefficient: ±100ppm/°C; Supplier 1: Digi-Key; Supplier Part Number 1: 311-4.70KHRCT-ND; RoHS: RoHS Compliant; Category: Resistors; Stock 1: 3487566; Pricing 1: 1=0.16, 10=0.022, 100=0.0089, 1000=0.00402, 2500=0.00349 (CAD); Packaging: Cut Tape (CT); Part Status: Active; Composition: Thick Film; Features: Moisture Resistant; Operating Temperature: -55°C ~ 155°C; Package / Case: 0603 (1608 Metric); Supplier Device Package: 0603; Size / Dimension: 0.063" L x 0.031" W (1.60mm x 0.80mm); Height - Seated (Max): 0.022" (0.55mm); Failure Rate: -; ComponentLink1URL: http://www.yageo.com/documents/recent/PYu-RC_Group_51_RoHS_L_7.pdf; ComponentLink1Description: http://www.yageo.com/documents/recent/PYu-RC_Group_51_RoHS_L_7.pdf; Tolerance: ±1%
U1 = IC OP AMP DUAL GP RR 10MHZ 8-VSSOP: General Purpose Amplifier 2 Circuit Rail-to-Rail 8-VSSOP; Manufacturer: Texas Instruments; Manufacturer Part Number: OPA2197IDGKR; Number of Circuits: 2; Slew Rate: 20V/µs; Input Bias Current: 5pA; Input Offset Voltage (Vos): 250uV; Operating Supply Current: 1mA; Output Current per Channel: 65mA; Supplier 1: Digi-Key; Stock 1: 2171; Pricing 1: 1=2.41, 10=2.162, 100=1.7376, 500=1.4276, 1000=1.1829 (USD); Mount: Surface Mount; Case/Package: VSSOP; Min Operating Temperature: -40°C; Max Operating Temperature: 125°C; Packaging: Tape and Reel; Gain Bandwidth Product: 10MHz; Number of Channels: 2; Lead Free: Lead Free; ComponentLink1URL: http://www.ti.com/lit/ds/symlink/opa2197.pdf; ComponentLink1Description: http://www.ti.com/lit/ds/symlink/opa2197.pdf; Supplier Part Number 1: 296-47349-1-ND

## Sheet Steering Wheel Interface Digital Inputs.SchDoc: Steering Wheel Interface - Digital Inputs
size B; Organization: Midnight Sun Solar Rayce Car Team; Address1: University of Waterloo; Address2: 200 University Ave W; Address3: Waterloo, ON, Canada; Address4: N2L 3E9; DocumentNumber: 3; SheetNumber: 4; SheetTotal: 5; Website: www.uwmidsun.com; ProjectName: ProjectName
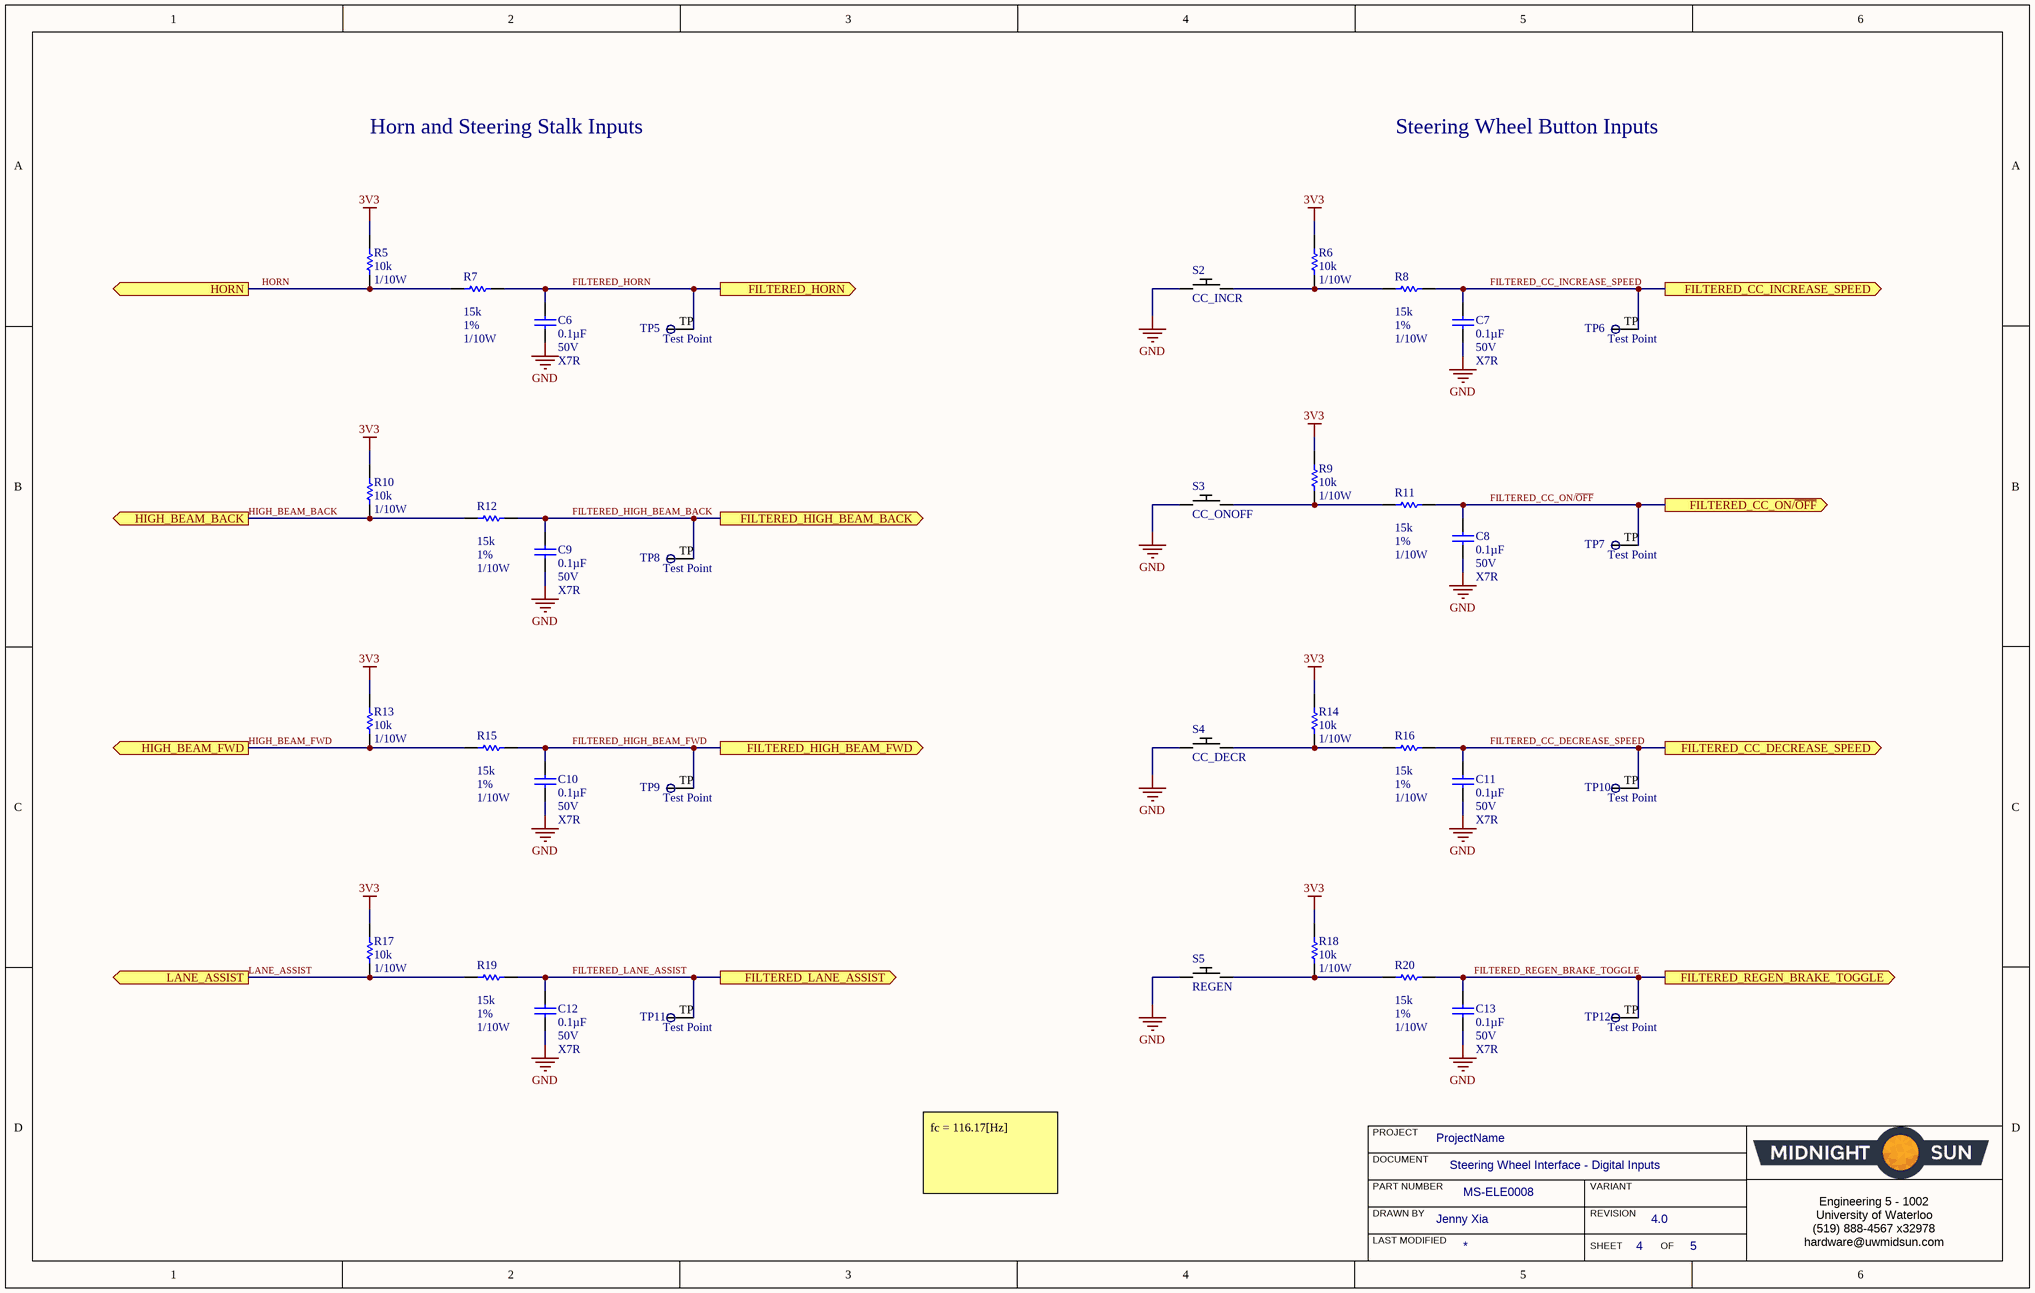
[diagram p3: Steering Wheel Interface Digital Inputs.SchDoc]

### Parts
C6  Capacitance: 0.1µF  Voltage: 50V  Temperature Coefficient: X7R  [CAP, 0603]  (hidden comment: CAP CER 0.1UF 50V 10% X7R 0603)
C7  Capacitance: 0.1µF  Voltage: 50V  Temperature Coefficient: X7R  [CAP, 0603]  (hidden comment: CAP CER 0.1UF 50V 10% X7R 0603)
C8  Capacitance: 0.1µF  Voltage: 50V  Temperature Coefficient: X7R  [CAP, 0603]  (hidden comment: CAP CER 0.1UF 50V 10% X7R 0603)
C9  Capacitance: 0.1µF  Voltage: 50V  Temperature Coefficient: X7R  [CAP, 0603]  (hidden comment: CAP CER 0.1UF 50V 10% X7R 0603)
C10  Capacitance: 0.1µF  Voltage: 50V  Temperature Coefficient: X7R  [CAP, 0603]  (hidden comment: CAP CER 0.1UF 50V 10% X7R 0603)
C11  Capacitance: 0.1µF  Voltage: 50V  Temperature Coefficient: X7R  [CAP, 0603]  (hidden comment: CAP CER 0.1UF 50V 10% X7R 0603)
C12  Capacitance: 0.1µF  Voltage: 50V  Temperature Coefficient: X7R  [CAP, 0603]  (hidden comment: CAP CER 0.1UF 50V 10% X7R 0603)
C13  Capacitance: 0.1µF  Voltage: 50V  Temperature Coefficient: X7R  [CAP, 0603]  (hidden comment: CAP CER 0.1UF 50V 10% X7R 0603)
R5  Resistance: 10k  Power: 1/10W  [RES, 0603]  (hidden comment: RES 10K OHM 1% 1/10W 0603)
R6  Resistance: 10k  Power: 1/10W  [RES, 0603]  (hidden comment: RES 10K OHM 1% 1/10W 0603)
R7  Resistance: 15k  Tolerance: 1%  Max Power Dissipation: 1/10W  [RES, 0603]  (hidden comment: RES SMD 15K OHM 1% 1/10W 0603)
R8  Resistance: 15k  Tolerance: 1%  Max Power Dissipation: 1/10W  [RES, 0603]  (hidden comment: RES SMD 15K OHM 1% 1/10W 0603)
R9  Resistance: 10k  Power: 1/10W  [RES, 0603]  (hidden comment: RES 10K OHM 1% 1/10W 0603)
R10  Resistance: 10k  Power: 1/10W  [RES, 0603]  (hidden comment: RES 10K OHM 1% 1/10W 0603)
R11  Resistance: 15k  Tolerance: 1%  Max Power Dissipation: 1/10W  [RES, 0603]  (hidden comment: RES SMD 15K OHM 1% 1/10W 0603)
R12  Resistance: 15k  Tolerance: 1%  Max Power Dissipation: 1/10W  [RES, 0603]  (hidden comment: RES SMD 15K OHM 1% 1/10W 0603)
R13  Resistance: 10k  Power: 1/10W  [RES, 0603]  (hidden comment: RES 10K OHM 1% 1/10W 0603)
R14  Resistance: 10k  Power: 1/10W  [RES, 0603]  (hidden comment: RES 10K OHM 1% 1/10W 0603)
R15  Resistance: 15k  Tolerance: 1%  Max Power Dissipation: 1/10W  [RES, 0603]  (hidden comment: RES SMD 15K OHM 1% 1/10W 0603)
R16  Resistance: 15k  Tolerance: 1%  Max Power Dissipation: 1/10W  [RES, 0603]  (hidden comment: RES SMD 15K OHM 1% 1/10W 0603)
R17  Resistance: 10k  Power: 1/10W  [RES, 0603]  (hidden comment: RES 10K OHM 1% 1/10W 0603)
R18  Resistance: 10k  Power: 1/10W  [RES, 0603]  (hidden comment: RES 10K OHM 1% 1/10W 0603)
R19  Resistance: 15k  Tolerance: 1%  Max Power Dissipation: 1/10W  [RES, 0603]  (hidden comment: RES SMD 15K OHM 1% 1/10W 0603)
R20  Resistance: 15k  Tolerance: 1%  Max Power Dissipation: 1/10W  [RES, 0603]  (hidden comment: RES SMD 15K OHM 1% 1/10W 0603)
S2  CC_INCR  [SW SPST-NO ESE-20C321]
S3  CC_ONOFF  [SW SPST-NO ESE-20C321]
S4  CC_DECR  [SW SPST-NO ESE-20C321]
S5  REGEN  [SW SPST-NO ESE-20C321]
TP5  Test Point  [Test Point]  (no BOM)
TP6  Test Point  [Test Point]  (no BOM)
TP7  Test Point  [Test Point]  (no BOM)
TP8  Test Point  [Test Point]  (no BOM)
TP9  Test Point  [Test Point]  (no BOM)
TP10  Test Point  [Test Point]  (no BOM)
TP11  Test Point  [Test Point]  (no BOM)
TP12  Test Point  [Test Point]  (no BOM)

### Ports
FILTERED_CC_DECREASE_SPEED (out), FILTERED_CC_INCREASE_SPEED (out), FILTERED_CC_ON/~{OFF} (out), FILTERED_HIGH_BEAM_BACK (out), FILTERED_HIGH_BEAM_FWD (out), FILTERED_HORN (out), FILTERED_LANE_ASSIST (out), FILTERED_REGEN_BRAKE_TOGGLE (out), HIGH_BEAM_BACK (out), HIGH_BEAM_FWD (out), HORN (out), LANE_ASSIST (out)

### Nets
3V3: R5.1 R6.1 R9.1 R10.1 R13.1 R14.1 R17.1 R18.1
GND: C6.2 C7.2 C8.2 C9.2 C10.2 C11.2 C12.2 C13.2 S2.1 S3.1 S4.1 S5.1
FILTERED_CC_DECREASE_SPEED: C11.1 R16.1 TP10.TP ; port FILTERED_CC_DECREASE_SPEED
FILTERED_CC_INCREASE_SPEED: C7.1 R8.1 TP6.TP ; port FILTERED_CC_INCREASE_SPEED
FILTERED_CC_ON/~{OFF}: C8.1 R11.1 TP7.TP ; port FILTERED_CC_ON/~{OFF}
FILTERED_HIGH_BEAM_BACK: C9.1 R12.1 TP8.TP ; port FILTERED_HIGH_BEAM_BACK
FILTERED_HIGH_BEAM_FWD: C10.1 R15.1 TP9.TP ; port FILTERED_HIGH_BEAM_FWD
FILTERED_HORN: C6.1 R7.1 TP5.TP ; port FILTERED_HORN
FILTERED_LANE_ASSIST: C12.1 R19.1 TP11.TP ; port FILTERED_LANE_ASSIST
FILTERED_REGEN_BRAKE_TOGGLE: C13.1 R20.1 TP12.TP ; port FILTERED_REGEN_BRAKE_TOGGLE
HIGH_BEAM_BACK: R10.2 R12.2 ; port HIGH_BEAM_BACK
HIGH_BEAM_FWD: R13.2 R15.2 ; port HIGH_BEAM_FWD
HORN: R5.2 R7.2 ; port HORN
LANE_ASSIST: R17.2 R19.2 ; port LANE_ASSIST
NetR6_2: R6.2 R8.2 S2.2
NetR9_2: R9.2 R11.2 S3.2
NetR14_2: R14.2 R16.2 S4.2
NetR18_2: R18.2 R20.2 S5.2

### Notes on the sheet
- Horn and Steering Stalk Inputs
- Steering Wheel Button Inputs
- PROJECT
- DOCUMENT
- fc = 116.17[Hz]
- DRAWN BY
- LAST MODIFIED
- PART NUMBER
- REVISION
- SHEET
- VARIANT
- OF
- Engineering 5 - 1002
  University of Waterloo
  (519) 888-4567 x32978
  hardware@uwmidsun.com

### Library data of the parts
C6-C13 = CAP CER 0.1UF 50V 10% X7R 0603: as C1 on sheet Steering Wheel Interface Analog Inputs; Supplier 1: Digi-Key; Supplier Part Number 1: 478-5052-1-ND; Packaging: Cut Tape (CT); Part Status: Active; Operating Temperature: -55°C ~ 125°C; Ratings: -; Mounting Type: Surface Mount, MLCC; Package / Case: 0603 (1608 Metric); Size / Dimension: 0.063" L x 0.032" W (1.60mm x 0.81mm); Height - Seated (Max): -; Thickness (Max): 0.035" (0.90mm); Lead Spacing: -; Lead Style: -; ComponentLink1URL: http://datasheets.avx.com/X7RDielectric.pdf; ComponentLink1Description: http://datasheets.avx.com/X7RDielectric.pdf; Tolerance: ±10%
R5 R6 R9 R10 R13 R14 R17 R18 = RES 10K OHM 1% 1/10W 0603: RES SMD 10K OHM 1% 1/10W 0603; Manufacturer 1: Yageo; Manufacturer Part Number 1: RC0603FR-0710KL; Temperature Coefficient: ±100ppm/°C; Supplier 1: Digi-Key; Supplier Part Number 1: 311-10.0KHRCT-ND; Packaging: Cut Tape (CT); Part Status: Active; Composition: Thick Film; Operating Temperature: -55°C ~ 155°C; Package / Case: 0603 (1608 Metric); Supplier Device Package: 0603; Size / Dimension: 0.063" L x 0.031" W (1.60mm x 0.80mm); Height - Seated (Max): 0.022" (0.55mm); Failure Rate: -; ComponentLink1URL: http://www.yageo.com/documents/recent/PYu-RC_Group_51_RoHS_L_7.pdf; ComponentLink1Description: http://www.yageo.com/documents/recent/PYu-RC_Group_51_RoHS_L_7.pdf; Tolerance: ±1%
R7 R8 R11 R12 R15 R16 R19 R20 = RES SMD 15K OHM 1% 1/10W 0603: as R2 on sheet Steering Wheel Interface Analog Inputs; Case/Package: 0603; Case Code (Imperial): 0603; Case Code (Metric): 1608; Min Operating Temperature: -55°C; Max Operating Temperature: 155°C; Packaging: Tape and Reel; Termination: SMD/SMT; Composition: Thick Film; Military Standard: Not; Voltage Rating (DC): 50V; Length: 1.6mm; Height: 0.022inch; Width: 0.031inch; Depth: 0.8mm; Lead Free: Lead Free; ComponentLink1URL: https://www.digikey.ca/product-detail/en/yageo/RC0603FR-0715KL/311-15.0KHRCT-ND/729900; ComponentLink1Description: Digikey; Features: Moisture Resistant; Number of Pins: 2; Number of Terminations: 2; Package Quantity: 1; REACH SVHC: Unknown; Supplier 1: Digi-Key; RoHS: Yes; Stock 1: 8611420; Pricing 1: 1 = 0.10000, 10 = 0.02400, 100 = 0.00970, 1000 = 0.00437, 2500 = 0.00379 (USD); ComponentLink2URL: http://www.yageo.com/documents/recent/PYu-RC_Group_51_RoHS_L_10.pdf; ComponentLink2Description: http://www.yageo.com/documents/recent/PYu-RC_Group_51_RoHS_L_10.pdf; ComponentLink3URL: http://www.yageo.com/documents/recent/PYu-RC_Group_51_RoHS_L_9.pdf; ComponentLink3Description: http://www.yageo.com/documents/recent/PYu-RC_Group_51_RoHS_L_9.pdf; ComponentLink4URL: https://www.verical.com/server-webapp/html/getDatasheet?partID=327895; ComponentLink4Description: https://www.verical.com/server-webapp/html/getDatasheet?partID=327895; Supplier Part Number 1: 311-15.0KHRCT-ND
S2-S5 = SW PUSH SPST-NO 0.1A 14V: as S1 on sheet Steering Wheel Carrier Board Mezzanine; Supplier 1: Digi-Key; Supplier Part Number 1: P11161S-ND; RoHS: Yes; Stock 1: 1919; Pricing 1: 1 = 1.17000, 10 = 1.09200, 25 = 1.04040, 50 = 0.98820, 100 = 0.96220, 250 = 0.93620, 500 = 0.88418, 1000 = 0.83216, 5000 = 0.70214 (USD); Packaging: Bulk; ComponentLink1URL: https://www.digikey.ca/product-detail/en/panasonic-electronic-components/ESE-20C321/P11161S-ND/354749; ComponentLink1Description: Digikey; Mount: Through Hole; Min Operating Temperature: -30°C; Max Operating Temperature: 80°C; Max Voltage Rating (DC): 14V; Package Quantity: 1200; Contact Current Rating: 100mA; Termination: PC Pin; Orientation: Straight; Radiation Hardening: No; REACH SVHC: No SVHC; Lead Free: Lead Free; ComponentLink2URL: https://datasheet.ciiva.com/46399/1790644-46399477.pdf?src-supplier=Element14; ComponentLink2Description: https://datasheet.ciiva.com/46399/1790644-46399477.pdf?src-supplier=Element14; ComponentLink3URL: https://datasheet.ciiva.com/16437/atu0000ce7-16437878.pdf?src-supplier=Future+Electronics; ComponentLink3Description: https://datasheet.ciiva.com/16437/atu0000ce7-16437878.pdf?src-supplier=Future+Electronics; ComponentLink4URL: https://datasheet.ciiva.com/8663/atu0000ce7-8663607.pdf?src-supplier=Avnet; ComponentLink4Description: https://datasheet.ciiva.com/8663/atu0000ce7-8663607.pdf?src-supplier=Avnet; ComponentLink5URL: https://datasheet.ciiva.com/2869/atu0000ce7-2869467.pdf?src-supplier=Digi-Key; ComponentLink5Description: https://datasheet.ciiva.com/2869/atu0000ce7-2869467.pdf?src-supplier=Digi-Key

## Sheet Steering Wheel Interface Schmitt Inverters.SchDoc: Steering Wheel Interface - Schmitt Inverters
size Tabloid; Organization: Midnight Sun Solar Rayce Car Team; Address1: University of Waterloo; Address2: 200 University Ave W; Address3: Waterloo, ON, Canada; Address4: N2L 3E9; DocumentNumber: 3; SheetNumber: 5; SheetTotal: 5; Website: www.uwmidsun.com; ProjectName: ProjectName
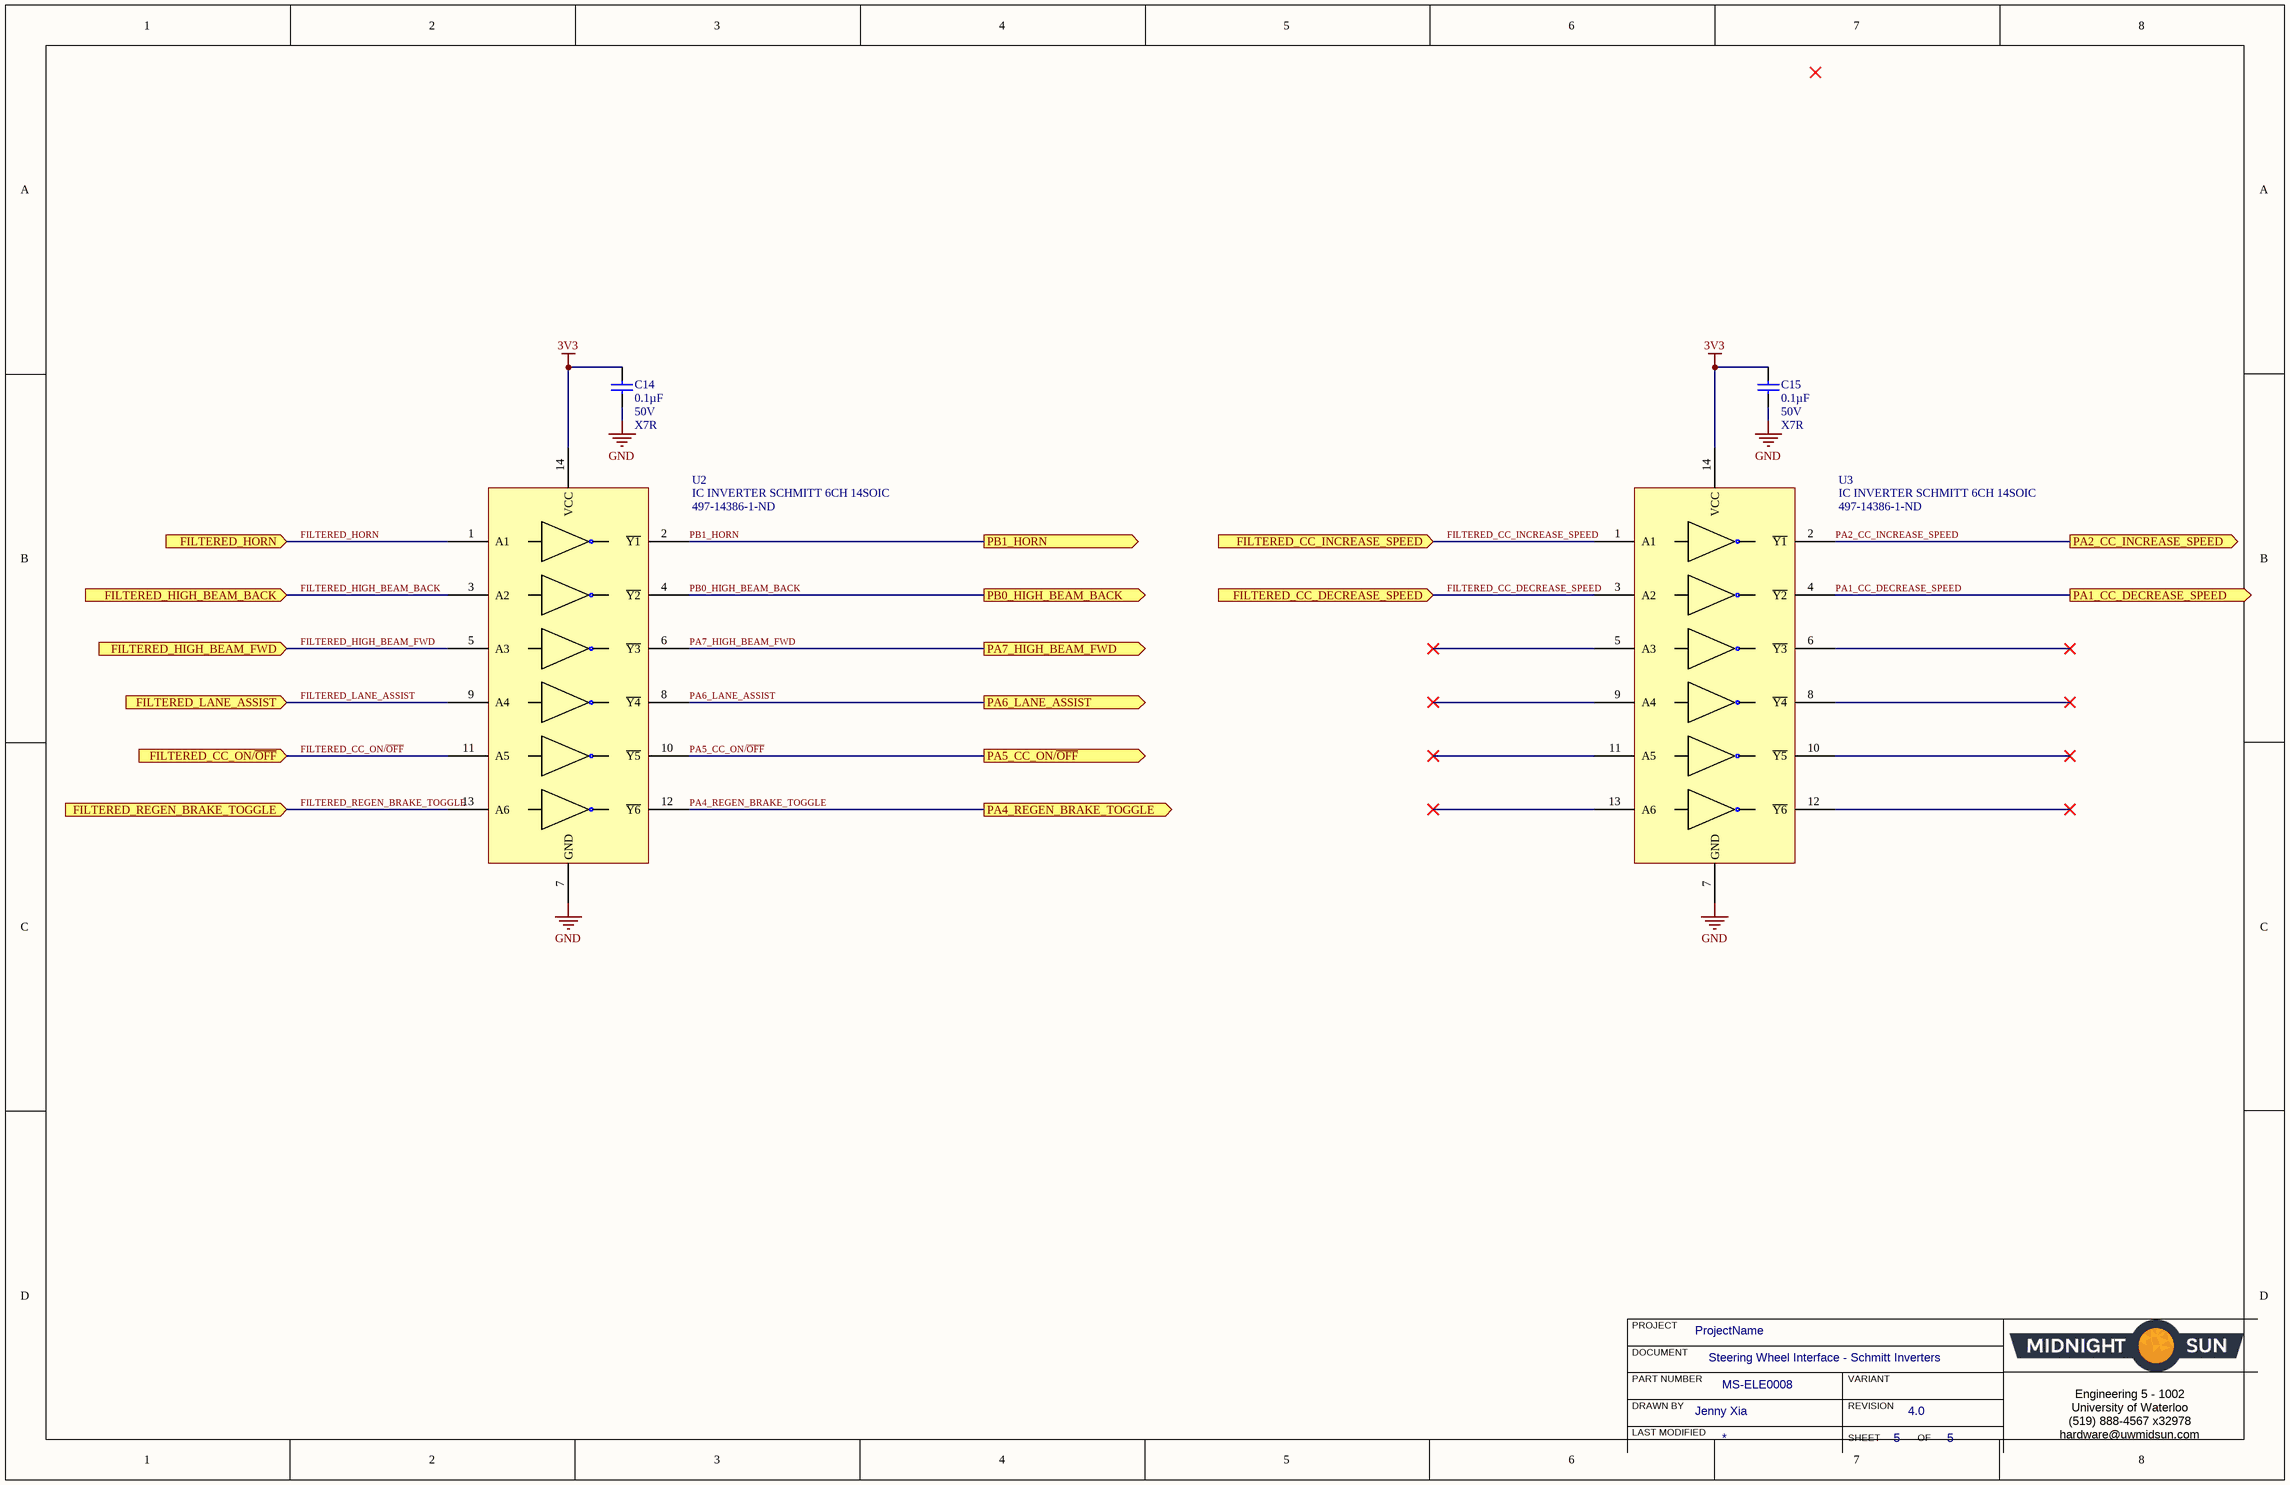
[diagram p4: Steering Wheel Interface Schmitt Inverters.SchDoc]

### Parts
C14  Capacitance: 0.1µF  Voltage: 50V  Temperature Coefficient: X7R  [CAP, 0603]  (hidden comment: CAP CER 0.1UF 50V 10% X7R 0603)
C15  Capacitance: 0.1µF  Voltage: 50V  Temperature Coefficient: X7R  [CAP, 0603]  (hidden comment: CAP CER 0.1UF 50V 10% X7R 0603)
U2  IC INVERTER SCHMITT 6CH 14SOIC  Supplier Part Number 1: 497-14386-1-ND  [IC INVERTER SCHMITT 6CH 14TSSOP]
U3  IC INVERTER SCHMITT 6CH 14SOIC  Supplier Part Number 1: 497-14386-1-ND  [IC INVERTER SCHMITT 6CH 14TSSOP]

### Ports
FILTERED_CC_DECREASE_SPEED (in), FILTERED_CC_INCREASE_SPEED (in), FILTERED_CC_ON/~{OFF} (in), FILTERED_HIGH_BEAM_BACK (in), FILTERED_HIGH_BEAM_FWD (in), FILTERED_HORN (in), FILTERED_LANE_ASSIST (in), FILTERED_REGEN_BRAKE_TOGGLE (in), PA1_CC_DECREASE_SPEED (out), PA2_CC_INCREASE_SPEED (out), PA4_REGEN_BRAKE_TOGGLE (out), PA5_CC_ON/~{OFF} (out), PA6_LANE_ASSIST (out), PA7_HIGH_BEAM_FWD (out), PB0_HIGH_BEAM_BACK (out), PB1_HORN (out)

### Nets
3V3: C14.1 C15.1 U2.14(VCC) U3.14(VCC)
GND: C14.2 C15.2 U2.7(GND) U3.7(GND)
FILTERED_CC_DECREASE_SPEED: U3.3(A2) ; port FILTERED_CC_DECREASE_SPEED
FILTERED_CC_INCREASE_SPEED: U3.1(A1) ; port FILTERED_CC_INCREASE_SPEED
FILTERED_CC_ON/~{OFF}: U2.11(A5) ; port FILTERED_CC_ON/~{OFF}
FILTERED_HIGH_BEAM_BACK: U2.3(A2) ; port FILTERED_HIGH_BEAM_BACK
FILTERED_HIGH_BEAM_FWD: U2.5(A3) ; port FILTERED_HIGH_BEAM_FWD
FILTERED_HORN: U2.1(A1) ; port FILTERED_HORN
FILTERED_LANE_ASSIST: U2.9(A4) ; port FILTERED_LANE_ASSIST
FILTERED_REGEN_BRAKE_TOGGLE: U2.13(A6) ; port FILTERED_REGEN_BRAKE_TOGGLE
PA1_CC_DECREASE_SPEED: U3.4(~{Y2}) ; port PA1_CC_DECREASE_SPEED
PA2_CC_INCREASE_SPEED: U3.2(~{Y1}) ; port PA2_CC_INCREASE_SPEED
PA4_REGEN_BRAKE_TOGGLE: U2.12(~{Y6}) ; port PA4_REGEN_BRAKE_TOGGLE
PA5_CC_ON/~{OFF}: U2.10(~{Y5}) ; port PA5_CC_ON/~{OFF}
PA6_LANE_ASSIST: U2.8(~{Y4}) ; port PA6_LANE_ASSIST
PA7_HIGH_BEAM_FWD: U2.6(~{Y3}) ; port PA7_HIGH_BEAM_FWD
PB0_HIGH_BEAM_BACK: U2.4(~{Y2}) ; port PB0_HIGH_BEAM_BACK
PB1_HORN: U2.2(~{Y1}) ; port PB1_HORN

Not connected (* = marked no-connect by the designer): U3 5(A3)* 6(~{Y3})* 8(~{Y4})* 9(A4)* 10(~{Y5})* 11(A5)* 12(~{Y6})* 13(A6)*

### Notes on the sheet
- PROJECT
- DOCUMENT
- PART NUMBER
- DRAWN BY
- LAST MODIFIED
- VARIANT
- REVISION
- SHEET
- OF
- Engineering 5 - 1002
  University of Waterloo
  (519) 888-4567 x32978
  hardware@uwmidsun.com
- Title
- Size:
- Date:
- Tabloid
- Number:
- Time:
- Revision:
- Sheet
- of
- File:

### Library data of the parts
C14 C15 = CAP CER 0.1UF 50V 10% X7R 0603: as C1 on sheet Steering Wheel Interface Analog Inputs; Supplier 1: Digi-Key; Supplier Part Number 1: 478-5052-1-ND; Packaging: Cut Tape (CT); Part Status: Active; Operating Temperature: -55°C ~ 125°C; Ratings: -; Mounting Type: Surface Mount, MLCC; Package / Case: 0603 (1608 Metric); Size / Dimension: 0.063" L x 0.032" W (1.60mm x 0.81mm); Height - Seated (Max): -; Thickness (Max): 0.035" (0.90mm); Lead Spacing: -; Lead Style: -; ComponentLink1URL: http://datasheets.avx.com/X7RDielectric.pdf; ComponentLink1Description: http://datasheets.avx.com/X7RDielectric.pdf; Tolerance: ±10%
U2 U3 = IC INVERTER SCHMITT 6CH 14TSSOP: Inverter IC 6 Channel Schmitt Trigger 14-SOIC; Manufacturer: STMicroelectronics; Manufacturer Part Number: M74HC14YRM13TR; Number of Inputs: 6; Propagation Delay: 21ns; Max Supply Voltage: 6V; Min Supply Voltage: 2V; Quiescent Current: 1uA; High Level Output Current: -5.2mA; Low Level Output Current: 5.2mA; Turn-On Delay Time: 190ns; ComponentLink1Description: Digikey; ComponentLink1URL: https://www.digikey.ca/product-detail/en/stmicroelectronics/M74HC14YTTR/497-14387-1-ND/4725844; Supplier 1: Digi-Key; RoHS: Yes; Stock 1: 28888; Pricing 1: 1 = 0.48000, 10 = 0.41300, 100 = 0.30860, 500 = 0.24246, 1000 = 0.18736 (USD); Mount: Surface Mount; Case/Package: SO; Number of Pins: 14; Weight: 0.009143oz; Min Operating Temperature: -40°C; Max Operating Temperature: 125°C; Packaging: Tape and Reel; Package Quantity: 2500; Logic Function: Inverter; Number of Circuits: 6; ComponentLink2URL: http://www.st.com/content/ccc/resource/technical/document/datasheet/19/a3/52/42/dd/ab/4b/46/CD00000263.pdf/files/CD00000263.pdf/jcr:content/translations/en.CD00000263.pdf; ComponentLink2Description: http://www.st.com/content/ccc/resource/technical/document/datasheet/19/a3/52/42/dd/ab/4b/46/CD00000263.pdf/files/CD00000263.pdf/jcr:content/translations/en.CD00000263.pdf; ComponentLink3URL: http://www.st.com/st-web-ui/static/active/en/resource/technical/document/datasheet/CD00000263.pdf; ComponentLink3Description: http://www.st.com/st-web-ui/static/active/en/resource/technical/document/datasheet/CD00000263.pdf; ComponentLink4Description: http://www.st.com/content/ccc/resource/technical/document/datasheet/19/a3/52/42/dd/ab/4b/46/CD00000263.pdf/files/CD00000263.pdf/jcr:content/translations/en.CD00000263.pdf?src-supplier=Digi-Key; ComponentLink4URL: http://www.st.com/content/ccc/resource/technical/document/datasheet/19/a3/52/42/dd/ab/4b/46/CD00000263.pdf/files/CD00000263.pdf/jcr:content/translations/en.CD00000263.pdf?src-supplier=Digi-Key; ComponentLink5Description: http://www.st.com/st-web-ui/static/active/en/resource/technical/document/datasheet/CD00000263.pdf?src-supplier=Avnet; ComponentLink5URL: http://www.st.com/st-web-ui/static/active/en/resource/technical/document/datasheet/CD00000263.pdf?src-supplier=Avnet; Number of Elements: 6

## Nets that join several sheets
3V3: Steering Wheel Carrier Board Mezzanine (6 pins), Steering Wheel Interface Analog Inputs (R1.1), Steering Wheel Interface Digital Inputs (8 pins), Steering Wheel Interface Schmitt Inverters (C14.1 C15.1 U2.14 U3.14)
+12V: Steering Wheel Carrier Board Mezzanine (5 pins), Steering Wheel Interface Analog Inputs (C1.1 C5.1 R4.1 U1.8)
GND: Steering Wheel Carrier Board Mezzanine (11 pins), Steering Wheel Steering Stalk Connector (P6.1 P6.6 P6.7 P7.1), Steering Wheel Interface Analog Inputs (8 pins), Steering Wheel Interface Digital Inputs (12 pins), Steering Wheel Interface Schmitt Inverters (C14.2 C15.2 U2.7 U3.7)
FILTERED_CC_DECREASE_SPEED: Steering Wheel Interface Digital Inputs (C11.1 R16.1 TP10.TP), Steering Wheel Interface Schmitt Inverters (U3.3)
FILTERED_CC_INCREASE_SPEED: Steering Wheel Interface Digital Inputs (C7.1 R8.1 TP6.TP), Steering Wheel Interface Schmitt Inverters (U3.1)
FILTERED_CC_ON/~{OFF}: Steering Wheel Interface Digital Inputs (C8.1 R11.1 TP7.TP), Steering Wheel Interface Schmitt Inverters (U2.11)
FILTERED_HIGH_BEAM_BACK: Steering Wheel Interface Digital Inputs (C9.1 R12.1 TP8.TP), Steering Wheel Interface Schmitt Inverters (U2.3)
FILTERED_HIGH_BEAM_FWD: Steering Wheel Interface Digital Inputs (C10.1 R15.1 TP9.TP), Steering Wheel Interface Schmitt Inverters (U2.5)
FILTERED_HORN: Steering Wheel Interface Digital Inputs (C6.1 R7.1 TP5.TP), Steering Wheel Interface Schmitt Inverters (U2.1)
FILTERED_LANE_ASSIST: Steering Wheel Interface Digital Inputs (C12.1 R19.1 TP11.TP), Steering Wheel Interface Schmitt Inverters (U2.9)
FILTERED_REGEN_BRAKE_TOGGLE: Steering Wheel Interface Digital Inputs (C13.1 R20.1 TP12.TP), Steering Wheel Interface Schmitt Inverters (U2.13)
HIGH_BEAM_BACK: Steering Wheel Carrier Board Mezzanine (P2.3), Steering Wheel Interface Digital Inputs (R10.2 R12.2)
HIGH_BEAM_FWD: Steering Wheel Carrier Board Mezzanine (P2.2), Steering Wheel Interface Digital Inputs (R13.2 R15.2)
HORN: Steering Wheel Carrier Board Mezzanine (P3.1), Steering Wheel Interface Digital Inputs (R5.2 R7.2)
LANE_ASSIST: Steering Wheel Carrier Board Mezzanine (P2.1), Steering Wheel Interface Digital Inputs (R17.2 R19.2)
PA1_CC_DECREASE_SPEED: Steering Wheel Carrier Board Mezzanine (P1.24), Steering Wheel Interface Schmitt Inverters (U3.4)
PA2_CC_INCREASE_SPEED: Steering Wheel Carrier Board Mezzanine (P1.23), Steering Wheel Interface Schmitt Inverters (U3.2)
PA3_AN3_TURN_SIGNAL_STALK: Steering Wheel Carrier Board Mezzanine (P1.22), Steering Wheel Interface Analog Inputs (C4.1 R3.1)
PA4_REGEN_BRAKE_TOGGLE: Steering Wheel Carrier Board Mezzanine (P1.21), Steering Wheel Interface Schmitt Inverters (U2.12)
PA5_CC_ON/~{OFF}: Steering Wheel Carrier Board Mezzanine (P1.20), Steering Wheel Interface Schmitt Inverters (U2.10)
PA6_LANE_ASSIST: Steering Wheel Carrier Board Mezzanine (P1.19), Steering Wheel Interface Schmitt Inverters (U2.8)
PA7_HIGH_BEAM_FWD: Steering Wheel Carrier Board Mezzanine (P1.18), Steering Wheel Interface Schmitt Inverters (U2.6)
PB0_HIGH_BEAM_BACK: Steering Wheel Carrier Board Mezzanine (P1.17), Steering Wheel Interface Schmitt Inverters (U2.4)
PB1_HORN: Steering Wheel Carrier Board Mezzanine (P1.16), Steering Wheel Interface Schmitt Inverters (U2.2)
TURN_SIGNAL_STALK: Steering Wheel Carrier Board Mezzanine (P2.4), Steering Wheel Interface Analog Inputs (C2.1 R1.2 R2.2)